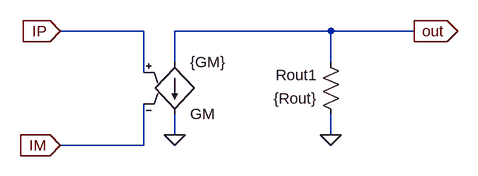
[diagram p0: schematic gm_model.asc]
gm_model.asc, the LTspice schematic file:
Version 4
SHEET 1 1088 852
WIRE 0 352 -128 352
WIRE 288 352 48 352
WIRE 416 352 288 352
WIRE 48 400 48 352
WIRE 288 400 288 352
WIRE 0 416 0 352
WIRE 48 512 48 480
WIRE 288 512 288 480
WIRE 0 528 0 464
WIRE 0 528 -128 528
FLAG -128 352 IP
IOPIN -128 352 In
FLAG -128 528 IM
IOPIN -128 528 In
FLAG 48 512 0
FLAG 416 352 out
IOPIN 416 352 Out
FLAG 288 512 0
SYMBOL g2 48 496 M180
SYMATTR InstName GM
SYMATTR Value {GM}
SYMBOL res 304 496 R180
WINDOW 0 36 76 Left 2
WINDOW 3 36 40 Left 2
SYMATTR InstName Rout1
SYMATTR Value {Rout}

The netlist it stands for:
* gm_model.asc
GM out 0 IP IM {GM}
Rout1 0 out {Rout}
.backanno
.end